# EAGLE design L293d-BreakOut (EAGLE 9.5.2)
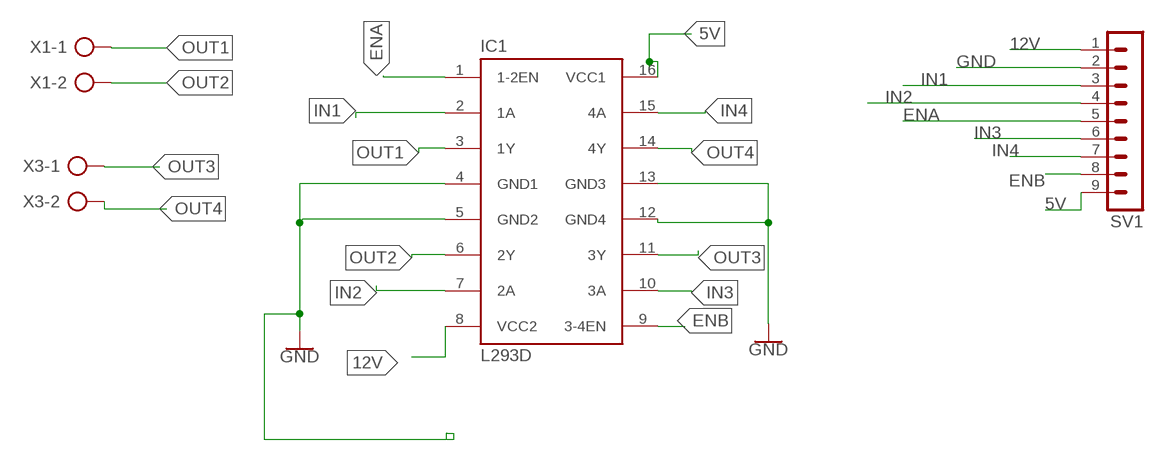
[diagram p0: schematic, sheet 1]

## Parts
IC1  L293D  [DIL16]
SV1  MA09-1W  [MA09-1W]
X1  AK500/2-H  [AK500/2-H]
X3  AK500/2-H  [AK500/2-H]

## Nets
5V: IC1.16(VCC1) SV1.9
12V: IC1.8(VCC2) SV1.1
ENA: IC1.1(1-2EN) SV1.5
ENB: IC1.9(3-4EN) SV1.8
GND: IC1.4(GND1) IC1.5(GND2) IC1.12(GND4) IC1.13(GND3) SV1.2
IN1: IC1.2(1A) SV1.3
IN2: IC1.7(2A) SV1.4
IN3: IC1.10(3A) SV1.6
IN4: IC1.15(4A) SV1.7
OUT1: IC1.3(1Y) X1.1
OUT2: IC1.6(2Y) X1.2
OUT3: IC1.11(3Y) X3.1
OUT4: IC1.14(4Y) X3.2

## Library data of the parts
IC1 = st-microelectronics:L293D: PUSH-PULL 4 CHANNEL DRIVER; MPN: L293D; OC_FARNELL: 9589619; OC_NEWARK: 56P8249
SV1 = con-lstb:MA09-1W: PIN HEADER; OC_FARNELL: unknown; OC_NEWARK: unknown
X1 X3 = con-ptr500:AK500/2-H: CONNECTOR Aug. 2004 / PTR Meßtechnik: Die Bezeichnung der Serie AK505 wurde geändert. Es handelt sich hierbei um AK500 in horizontaler Ausführung.; OC_FARNELL: unknown; OC_NEWARK: unknown

## Board
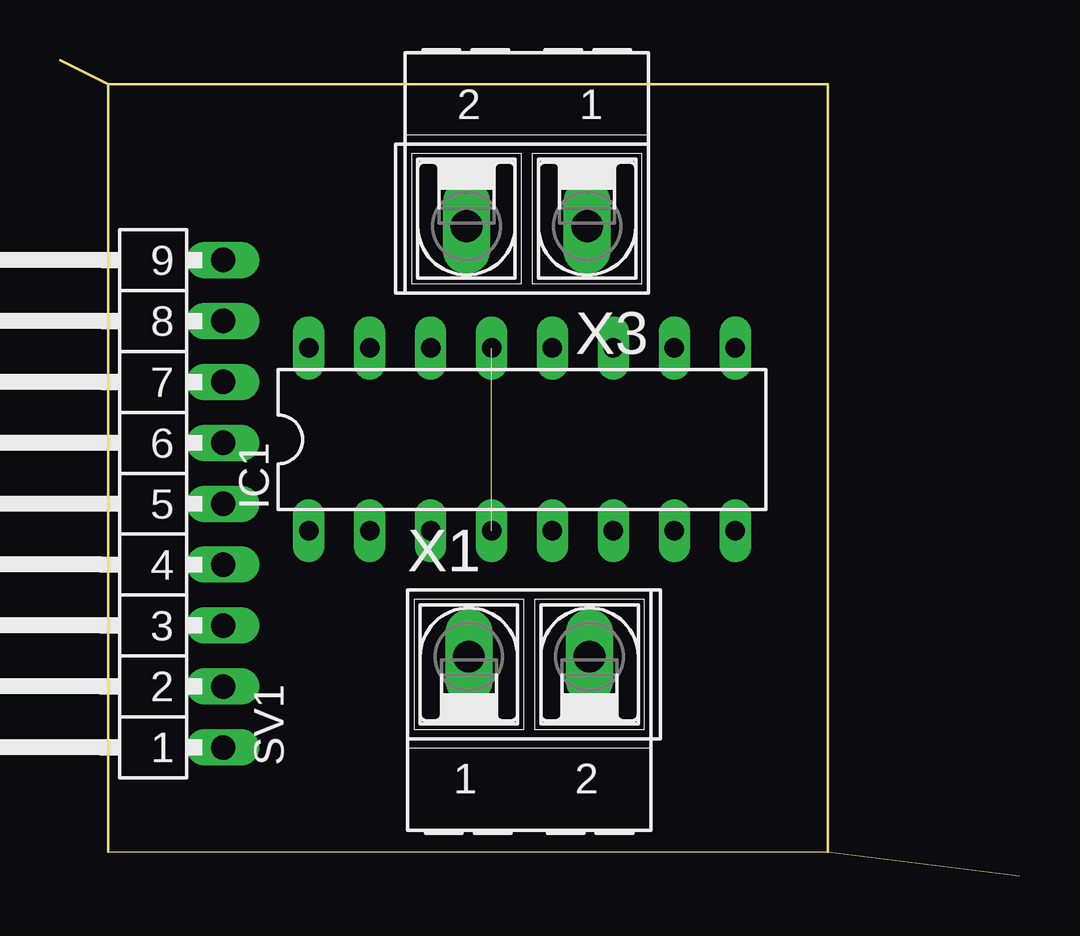
[diagram p1: board, top side]
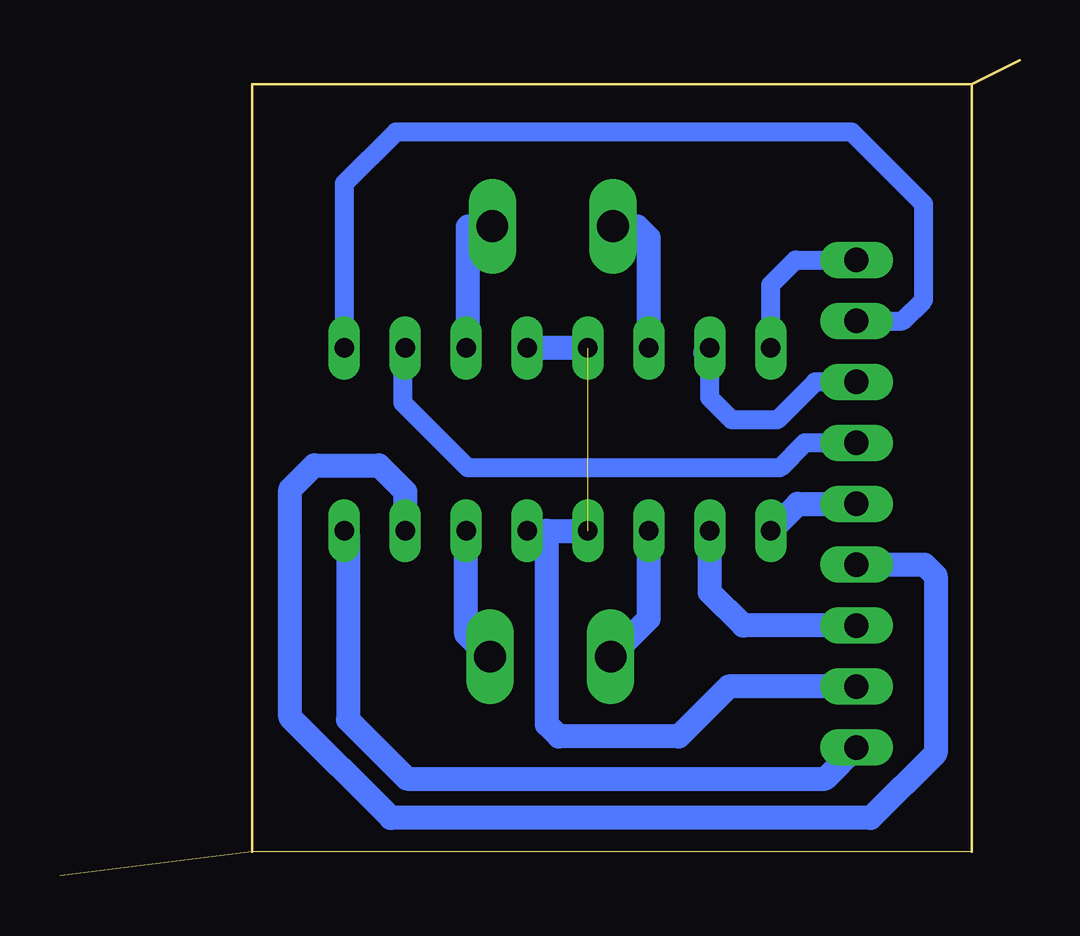
[diagram p2: board, bottom side, seen from below]

Size 40 x 34 mm. Coordinates in mm from the lower left corner, seen from the top.
Outline: 32,1 2,1 2,33
Outline: 32,1 40,0
Outline: 2,33 0,34
Outline: 2,33 32,33 32,1
Copper layers (1*16): Top 0.035mm / dielectric 1.5mm / Bottom 0.035mm
Design rules "default *": minimum track width 0.8mm, minimum drill 0.35mm, track to track 0.6mm, track to pad 0.8mm, pad to pad 6mil, via to via 6mil, smd to smd 6mil, copper to edge 40mil, drill to drill 6mil, minimum pad ring 10mil, minimum via ring 8mil, stop-mask expansion 4mil, vias tented up to drill 0mil, thermal gap 10mil

### Footprints (pad centres in the part's own frame; a part is rotated, then mirrored left to right if it is on the bottom)
DIL16 = drill 0.813 long: 1 -8.89,-3.81; 2 -6.35,-3.81; 3 -3.81,-3.81; 4 -1.27,-3.81; 5 1.27,-3.81; 6 3.81,-3.81; 7 6.35,-3.81; 8 8.89,-3.81; 9 8.89,3.81; 10 6.35,3.81; 11 3.81,3.81; 12 1.27,3.81; 13 -1.27,3.81; 14 -3.81,3.81; 15 -6.35,3.81; 16 -8.89,3.81
MA09-1W = drill 1.016 long: 1 -10.16,0; 2 -7.62,0; 3 -5.08,0; 4 -2.54,0; 5 0,0; 6 2.54,0; 7 5.08,0; 8 7.62,0; 9 10.16,0
AK500/2-H = drill 1.321 long: 1 -2.515,0; 2 2.515,0

### Placement (x,y rotation side)
IC1  19.26,18.18 0 top
SV1  6.8,15.5 90 top
X1  19.56,9.12 0 top
X3  19.46,27.07 180 top

### Tracks (layer width: path | path; a pad name or v marks a point on that pad's centre or on a via)
5V
  Bottom 0.8: IC1.16 10.37,24.63 9.34,25.66 SV1.9
12V
  Bottom 1: IC1.8 28,14.22 28,6.5 25.54,4.04 8.1,4.04 SV1.1
ENA
  Bottom 1: IC1.1 9.24,15.5 SV1.5
ENB
  Bottom 0.8: SV1.8 4.88,23.12 4,24 4,28 7,31 26,31 28.15,28.85 IC1.9
GND  (1 unrouted)
  Bottom 1: IC1.13 IC1.12 | IC1.5 19.7,14.37 | 19.7,14.37 IC1.4 | SV1.2 12.12,7.88 14.2,5.8 19.2,5.8 19.7,6.3 19.7,14.37
IN1
  Bottom 1: SV1.3 11.52,10.42 12.91,11.81 IC1.2
IN2
  Bottom 1: SV1.4 3.96,12.96 3.5,12.5 3.5,5.1 6.2,2.4 26.2,2.4 30.4,6.6 30.4,16.1 29.4,17.1 26.7,17.1 25.61,16.01 IC1.7
IN3
  Bottom 0.8: SV1.6 8.96,18.04 10,17 23,17 25.7,19.7 25.7,21.9
  Bottom 1: 25.7,21.9 IC1.10
IN4
  Bottom 0.8: SV1.7 8.52,20.58 10.1,19 12,19 12.91,19.91 IC1.15
  Bottom 1: SV1.7 7.72,20.58 | 13.1,21.8 IC1.15
OUT1
  Bottom 1: X1.1 15.45,10.72 IC1.3
OUT2
  Bottom 1: IC1.6 23.07,10.07 22.12,9.12 X1.2
OUT3
  Bottom 1: X3.1 22.98,27.07 23,27.05 23,22.06 IC1.11
OUT4
  Bottom 1: X3.2 15.95,27.07 15.45,26.58 IC1.14